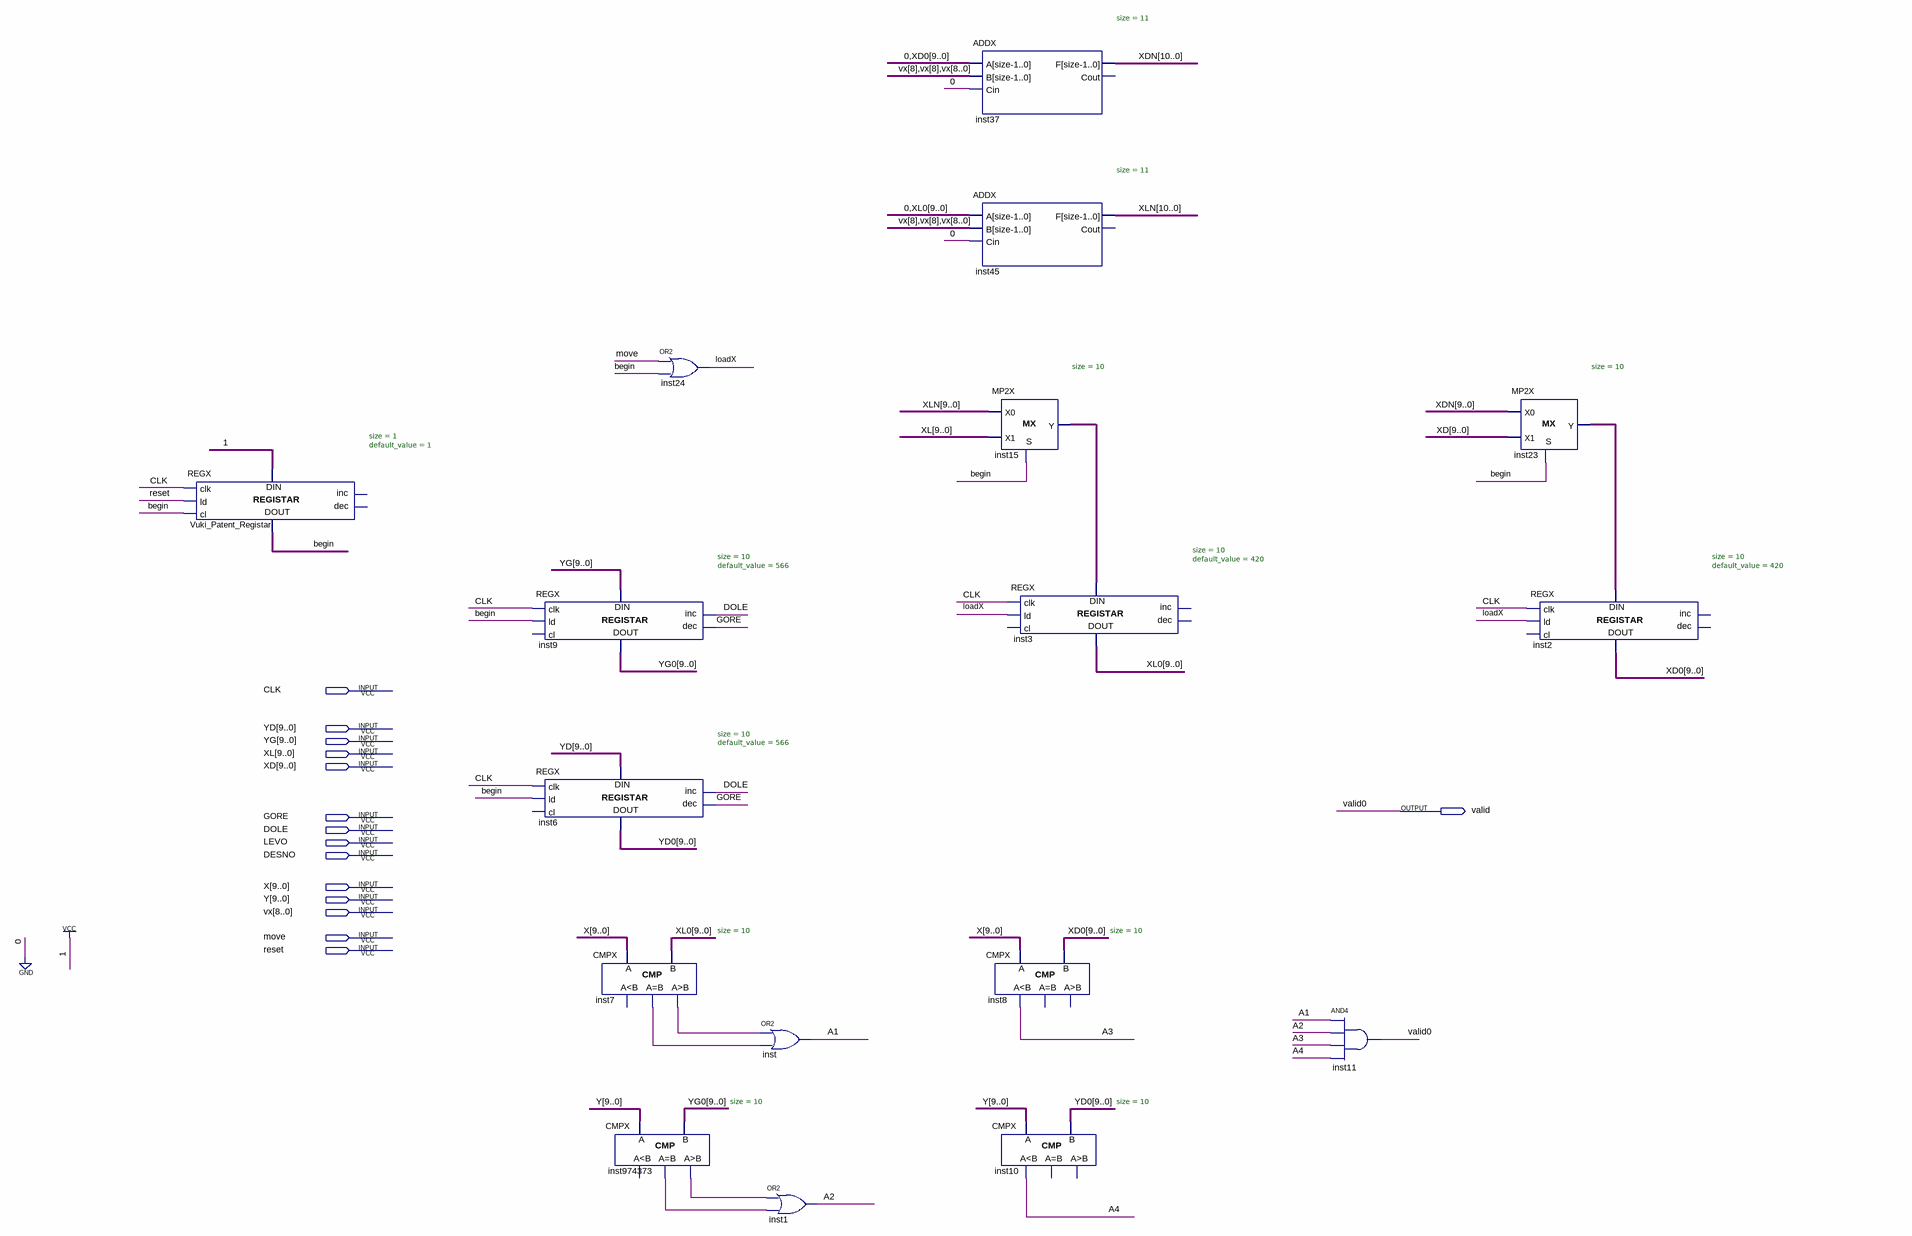
[diagram p0: schematic sheet]
// Quartus schematic pokeBlok.bdf as structural Verilog: 17 symbols, 15 pins
module pokeBlok (
  input  CLK,
  input  [9:0] YD,
  input  [9:0] YG,
  input  [9:0] XL,
  input  [9:0] XD,
  input  GORE,
  input  DOLE,
  input  LEVO,
  input  DESNO,
  input  [9:0] X,
  input  [9:0] Y,
  input  [8:0] vx,
  input  move,
  input  reset,
  output valid
);

  wire A1, A2, A3, A4, \begin , inst7_eq, inst7_gr, inst974373_eq, inst974373_gr, loadX;
  wire [9:0] inst15_y, inst23_y, XD0, XL0, YD0, YG0;
  wire [10:0] XDN, XLN;

  REGX #(.size(1), .default_value(1)) Vuki_Patent_Registar (
    .clk(CLK), .ld(reset), .cl(\begin ), .data_in(1'b1), .data_out(\begin ));  // open: inc, dec
  REGX #(.size(10), .default_value(566)) inst9 (
    .clk(CLK), .ld(\begin ), .inc(DOLE), .dec(GORE), .data_in(YG), .data_out(YG0));  // open: cl
  REGX #(.size(10), .default_value(566)) inst6 (
    .clk(CLK), .ld(\begin ), .inc(DOLE), .dec(GORE), .data_in(YD), .data_out(YD0));  // open: cl
  CMPX #(.size(10)) inst7 (.A(X), .B(XL0), .eq(inst7_eq), .gr(inst7_gr));  // open: ls
  CMPX #(.size(10)) inst974373 (.A(Y), .B(YG0), .eq(inst974373_eq), .gr(inst974373_gr));  // open: ls
  or inst24 (loadX, move, \begin );
  or inst (A1, inst7_gr, inst7_eq);
  or inst1 (A2, inst974373_gr, inst974373_eq);
  ADDX #(.size(11)) inst37 (.A({1'b0, XD0}), .B({{3{vx[8]}}, vx[7:0]}), .Cin(1'b0), .F(XDN));  // open: Cout
  ADDX #(.size(11)) inst45 (.A({1'b0, XL0}), .B({{3{vx[8]}}, vx[7:0]}), .Cin(1'b0), .F(XLN));  // open: Cout
  MP2X #(.size(10)) inst15 (.S(\begin ), .X0(XLN[9:0]), .X1(XL), .Y(inst15_y));
  REGX #(.size(10), .default_value(420)) inst3 (
    .clk(CLK), .ld(loadX), .data_in(inst15_y), .data_out(XL0));  // open: cl, inc, dec
  CMPX #(.size(10)) inst8 (.A(X), .B(XD0), .ls(A3));  // open: eq, gr
  CMPX #(.size(10)) inst10 (.A(Y), .B(YD0), .ls(A4));  // open: eq, gr
  and inst11 (valid, A1, A2, A3, A4);
  MP2X #(.size(10)) inst23 (.S(\begin ), .X0(XDN[9:0]), .X1(XD), .Y(inst23_y));
  REGX #(.size(10), .default_value(420)) inst2 (
    .clk(CLK), .ld(loadX), .data_in(inst23_y), .data_out(XD0));  // open: cl, inc, dec

  // Other names for the same wires on the sheet: valid0 = valid
endmodule
